# Altium schematic sheet DAC.SchDoc: MIDI-CV Converter: D-A Converter
size Letter; Engineer: Nicholas Morrow; DocumentNumber: 3; SheetNumber: 3; SheetTotal: 5; Project: GARY Synthesizer
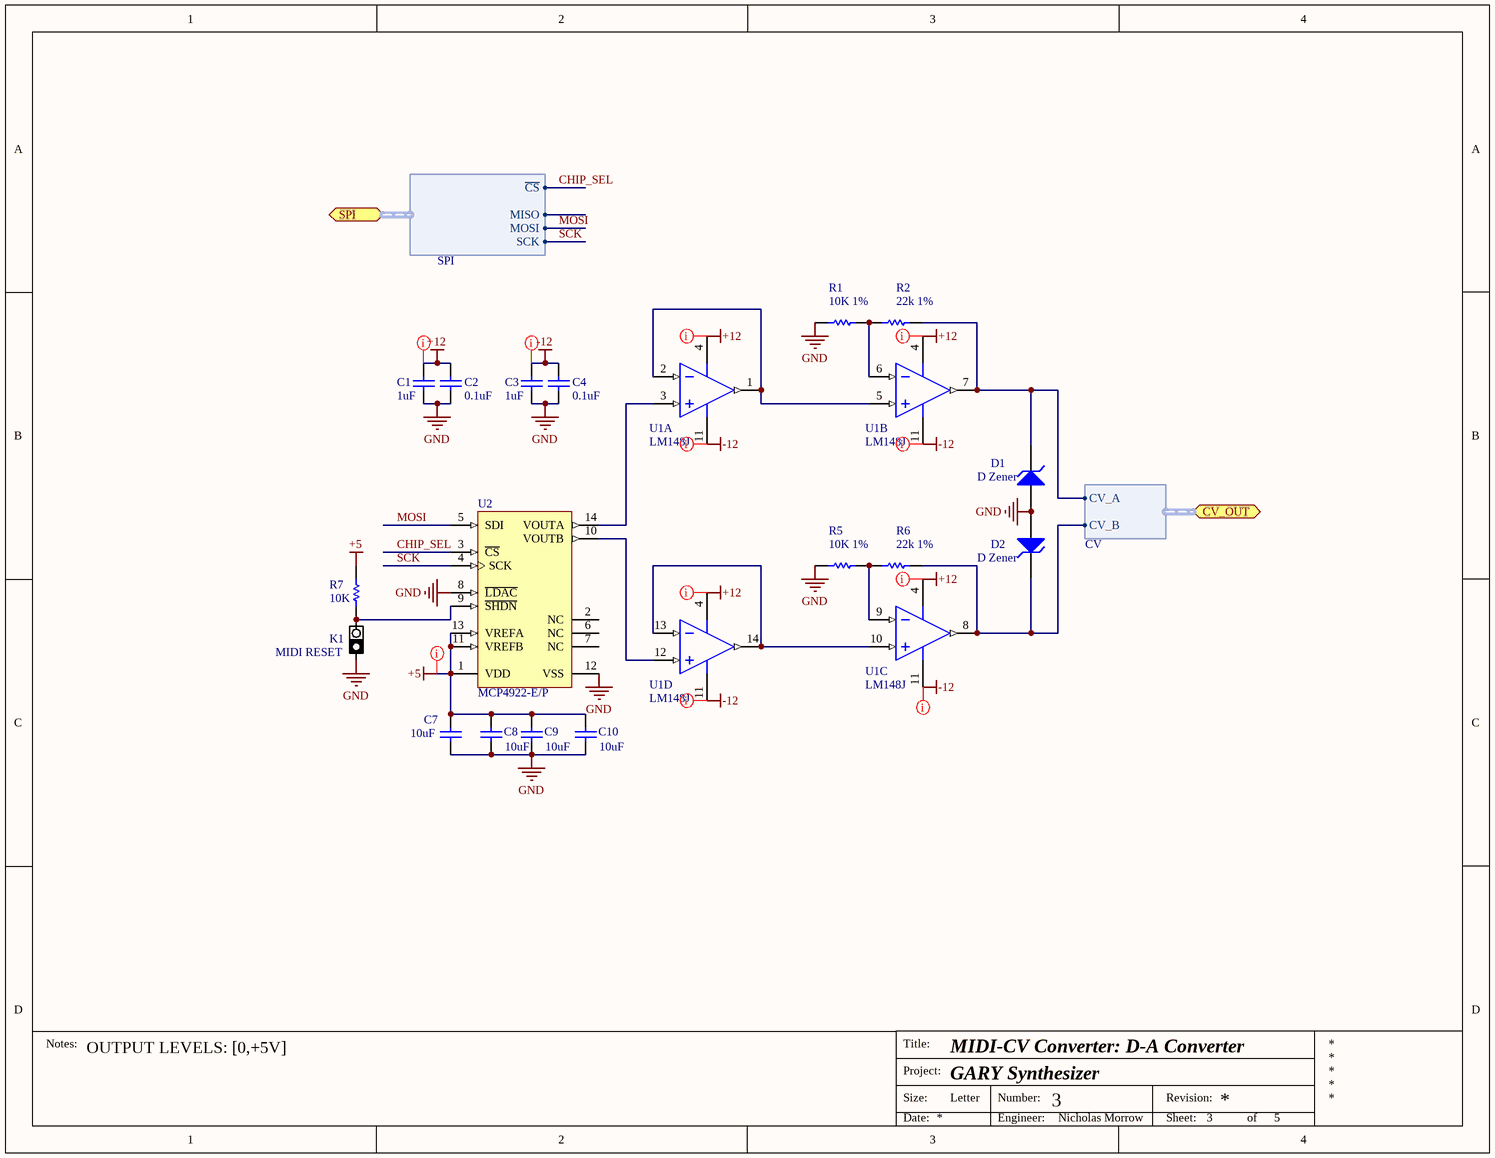
[diagram p0: DAC.SchDoc]

## Parts
C1  value 1uF  [CAP 5X11]  (hidden comment: Cap)
C2  value 0.1uF  [CAP 5X11]  (hidden comment: Cap)
C3  value 1uF  [CAP 5X11]  (hidden comment: Cap)
C4  value 0.1uF  [CAP 5X11]  (hidden comment: Cap)
C7  value 10uF  [CAP 5X11]  (hidden comment: Cap)
C8  value 10uF  [CAP 5X11]  (hidden comment: Cap)
C9  value 10uF  [CAP 5X11]  (hidden comment: Cap)
C10  value 10uF  [CAP 5X11]  (hidden comment: Cap)
D1  D Zener  [DIODE-0.4]
D2  D Zener  [DIODE-0.4]
K1  MIDI RESET  [JMPR2]
R1  value 10K 1%  [AXIAL-0.3]
R2  value 22k 1%  [AXIAL-0.3]
R5  value 10K 1%  [AXIAL-0.3]
R6  value 22k 1%  [AXIAL-0.3]
R7  value 10K  [AXIAL-0.3]
U1  LM148J  [J14A]  (parts A,B,C,D of 4)
U2  MCP4922-E/P  [PDIP300-P14]

## Ports
CV_OUT (harness CV), SPI (harness SPI)

## Harnesses
CV: CV_A, CV_B
SPI: MISO, MOSI, SCK, ~{CS}

## Nets
+5: C7.2 C8.2 C9.2 C10.2 R7.2 U2.1(VDD) U2.11(VREFB) U2.13(VREFA)
+12: C1.2 C2.2 U1.4(V+)
-12: C3.2 C4.2 U1.11(V-)
GND: C1.1 C2.1 C3.1 C4.1 C7.1 C8.1 C9.1 C10.1 D1.1(A) D2.1(A) K1.1 R1.2 R5.2 U2.8(~{LDAC}) U2.12(VSS)
CHIP_SEL: U2.3(~{CS}) ; port SPI.~{CS}
MOSI: U2.5(SDI) ; port SPI.MOSI
SCK: U2.4(SCK) ; port SPI.SCK
NetD1_2: D1.2(K) R2.1 U1.7(OUT2) ; port CV_OUT.CV_A
NetD2_2: D2.2(K) R6.1 U1.8(OUT3) ; port CV_OUT.CV_B
NetK1_2: K1.2 R7.1 U2.9(~{SHDN})
NetR1_1: R1.1 R2.2 U1.6(IN2-)
NetR5_1: R5.1 R6.2 U1.9(IN3-)
NetU1_1: U1.1(OUT1) U1.2(IN1-) U1.5(IN2+)
NetU1_3: U1.3(IN1+) U2.14(VOUTA)
NetU1_10: U1.10(IN3+) U1.13(IN4-) U1.14(OUT4)
NetU1_12: U1.12(IN4+) U2.10(VOUTB)

Not connected (* = marked no-connect by the designer): U2 2(NC) 6(NC) 7(NC)

## Layout directives
net class Power: +5, +12, -12

## Notes on the sheet
- OUTPUT LEVELS: [0,+5V]
- Notes:
- Title:
- Size:
- Project:
- Letter
- Number:
- Revision:
- Date:
- Engineer:
- Sheet:
- of

## Library data of the parts
C1-C4 C7-C10 = Cap: Capacitor; Published: 8-Jun-2000; LatestRevisionDate: 17-Jul-2002; LatestRevisionNote: Re-released for DXP Platform.; PackageReference: RAD-0.3; Publisher: Altium Limited; PackageDescription: Radial Cap, Thru-Hole; 2 Leads; 0.3 in Pin Spacing
D1 D2 = D Zener: Zener Diode; Manufacturer: NXP Semiconductors; Manufacturer Part Number: NZX3V0C,133; Voltage - Zener (Nom) (Vz): 3V; Tolerance: ±3%; Power - Max: 500mW; Impedance (Max) (Zzt): 100 Ohm; Current - Reverse Leakage @ Vr: 10µA @ 1V; Voltage - Forward (Vf) (Max) @ If: 1.5V @ 200mA; Published: 8-Jun-2000; LatestRevisionDate: 17-Jul-2002; LatestRevisionNote: Re-released for DXP Platform.; PackageReference: DIODE-0.7; Publisher: Altium Limited; PackageDescription: Diode, Thru-Hole; 2 Leads; 0.7 in Pin Spacing; Supplier 1: Digi-Key; RoHS: RoHS non-compliant; Category: Discrete Semiconductor Products; Stock 1: 16581; Pricing 1: 1=0.21, 10=0.191, 25=0.174, 100=0.1251, 250=0.07372, 500=0.06116, 1000=0.04172, 2500=0.0355 (USD); Packaging: Cut Tape (CT); Operating Temperature: -55°C ~ 175°C; Mounting Type: Through Hole; Package / Case: DO-204AH, DO-35, Axial; Supplier Device Package: ALF2; ComponentLink1URL: http://www.nxp.com/documents/data_sheet/NZX_SER.pdf; ComponentLink1Description: http://www.nxp.com/documents/data_sheet/NZX_SER.pdf
K1 = JMPR2: JMPR2 OPEN BY DEFAULT; Manufacturer: Sullins Connector Solutions; Manufacturer Part Number: PBC36SAAN; Supplier 1: Digi-Key; Supplier Part Number 1: S1011E-36-ND; Reel: Open
R1 R2 R5-R7 = Res1: Resistor; Published: 8-Jun-2000; LatestRevisionDate: 17-Jul-2002; LatestRevisionNote: Re-released for DXP Platform.; PackageReference: AXIAL-0.3; Publisher: Altium Limited; PackageDescription: Axial Device, Thru-Hole; 2 Leads; 0.3 in Pin Spacing
U1 = LM148J: Series Quad 741 Op Amp, 14-pin CerDIP; Manufacturer: National Semiconductor; PackageTopMarking: NSUZXYYTT*LM148J; PowerWise: N; CompType: Amplifiers; High-Reliability: Y; DatasheetVersion: Nov-2003; PackageVersion: revJ, Jul-2002; PackageReference: J14A; PackageDescription: Cerdip, .400 x .310in Body, 14 Lead, .300in Centers, .100in Pitch; PartNumber: LM148J; RoHS: N; PinCount: 14; ComponentLink1Description: Manufacturer URL; ComponentLink1URL: http://www.national.com/; ComponentLink2Description: LM148 Datasheet; ComponentLink2URL: http://www.national.com/ds/LM/LM148.pdf; ComponentLink3Description: LM148 Web Page; ComponentLink3URL: http://www.national.com/pf/LM/LM148.html; ComponentLink4Description: J14A Package Page; ComponentLink4URL: http://www.national.com/packaging/folders/j14a.html
U2 = MCP4922-E/P: 12-Bit DAC with SPI Interface, 14-Pin PDIP, Extended Temperature; Manufacturer: Microchip; Settling Time: 4.5µs; Number of Bits: 12; Number of Converters: 2; Voltage Supply Source: Single Supply; Number of Outputs and Type: 2 Voltage, Unipolar; 2 Voltage, Bipolar; DatasheetVersion: revA, Apr-2010; PackageVersion: revBB, Aug-2009; PackageReference: PDIP300-P14; PackageDescription: 14-Lead Plastic Dual In-Line (P) - 300 mil Body [PDIP]; Supplier 1: Digi-Key; Supplier Part Number 1: MCP4922-E/P-ND; Supplier 2: Farnell; Supplier Part Number 2: 1292244; Supplier 3: Newark; Supplier Part Number 3: 61K2950; Supplier 4: Mouser; Supplier Part Number 4: 579-MCP4922-E/P; Mounting Technology: Through Hole; PartNumber: MCP4922-E/P; ComponentLink1Description: Manufacturer URL; ComponentLink1URL: http://www.microchip.com/; ComponentLink2Description: Datasheet; ComponentLink2URL: http://ww1.microchip.com/downloads/en/DeviceDoc/22250A.pdf; ComponentLink3Description: Package Specification; ComponentLink3URL: http://www.microchip.com/stellent/groups/techpub_sg/documents/packagingspec/en012702.pdf; Manufacturer Part Number: MCP4922-E/P; RoHS: RoHS Compliant; Category: Integrated Circuits (ICs); Stock 1: 1015; Pricing 1: 1=3.14, 10=2.62, 25=2.19, 100=1.99 (USD); Packaging: Tube; Data Interface: SPI; Operating Temperature: -40°C ~ 125°C; Mounting Type: Through Hole; Package / Case: 14-DIP (0.300", 7.62mm); Supplier Device Package: 14-PDIP; Sampling Rate (Per Second): *; ComponentLink4URL: http://www.microchip.com/mymicrochip/filehandler.aspx?ddocname=en547858; ComponentLink4Description: http://www.microchip.com/mymicrochip/filehandler.aspx?ddocname=en547858